# Altium schematic sheet FPGA_Banks.SchDoc
size A3; SheetNumber: 1; SheetTotal: 5
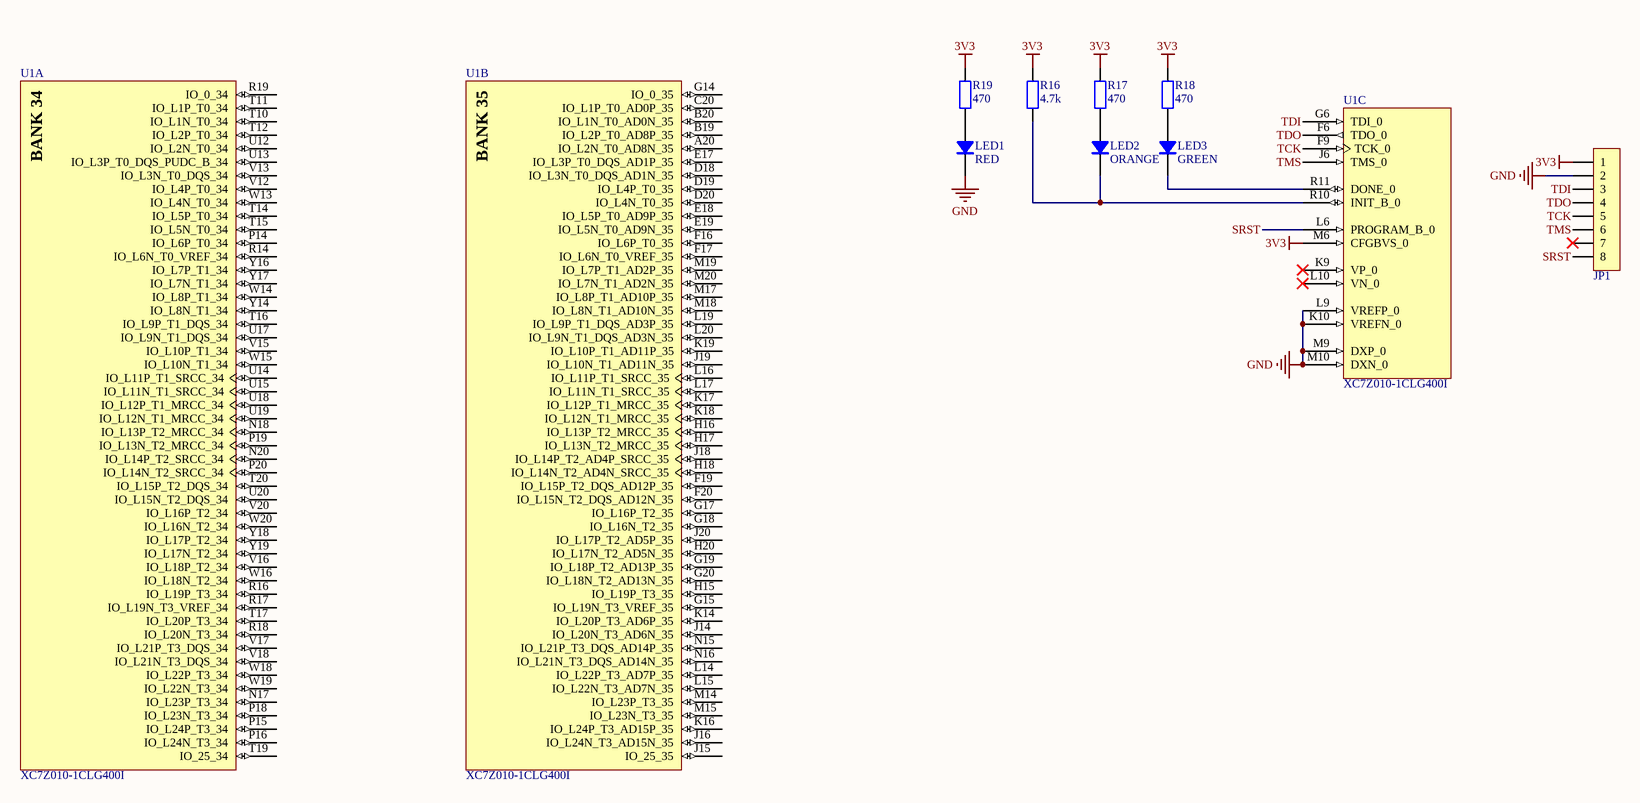
[diagram p0: FPGA_Banks.SchDoc]

## Parts
JP1  HDR-1X8  [HDR2.54-LI-8P]  (value not drawn)
LED1  RED  [LED 0603R]
LED2  ORANGE  [LED 0603Y]
LED3  GREEN  [LED 0603G]
R16  4.7k  [R0402]
R17  470  [R0402]
R18  470  [R0402]
R19  470  [R0402]
U1  XC7Z010-1CLG400I  [CLG400]  (parts A,B,C of 9)

## Nets
3V3: JP1.1 R16.1 R17.1 R18.1 R19.1 U1.M6(CFGBVS_0)
GND: JP1.2 LED1.2(K) U1.K10(VREFN_0) U1.L9(VREFP_0) U1.M9(DXP_0) U1.M10(DXN_0)
SRST: JP1.8 U1.L6(PROGRAM_B_0)
TCK: JP1.5 U1.F9(TCK_0)
TDI: JP1.3 U1.G6(TDI_0)
TDO: JP1.4 U1.F6(TDO_0)
TMS: JP1.6 U1.J6(TMS_0)
NetLED1_1: LED1.1(A) R19.2
NetLED2_1: LED2.1(A) R17.2
NetLED2_2: LED2.2(K) R16.2 U1.R10(INIT_B_0)
NetLED3_1: LED3.1(A) R18.2
NetLED3_2: LED3.2(K) U1.R11(DONE_0)

Not connected (* = marked no-connect by the designer): JP1 7*; U1 A20(IO_L2N_T0_AD8N_35) B19(IO_L2P_T0_AD8P_35) B20(IO_L1N_T0_AD0N_35) C20(IO_L1P_T0_AD0P_35) D18(IO_L3N_T0_DQS_AD1N_35) D19(IO_L4P_T0_35) D20(IO_L4N_T0_35) E17(IO_L3P_T0_DQS_AD1P_35) E18(IO_L5P_T0_AD9P_35) E19(IO_L5N_T0_AD9N_35) F16(IO_L6P_T0_35) F17(IO_L6N_T0_VREF_35) F19(IO_L15P_T2_DQS_AD12P_35) F20(IO_L15N_T2_DQS_AD12N_35) G14(IO_0_35) G15(IO_L19N_T3_VREF_35) G17(IO_L16P_T2_35) G18(IO_L16N_T2_35) G19(IO_L18P_T2_AD13P_35) G20(IO_L18N_T2_AD13N_35) H15(IO_L19P_T3_35) H16(IO_L13P_T2_MRCC_35) H17(IO_L13N_T2_MRCC_35) H18(IO_L14N_T2_AD4N_SRCC_35) H20(IO_L17N_T2_AD5N_35) J14(IO_L20N_T3_AD6N_35) J15(IO_25_35) J16(IO_L24N_T3_AD15N_35) J18(IO_L14P_T2_AD4P_SRCC_35) J19(IO_L10N_T1_AD11N_35) J20(IO_L17P_T2_AD5P_35) K9(VP_0)* K14(IO_L20P_T3_AD6P_35) K16(IO_L24P_T3_AD15P_35) K17(IO_L12P_T1_MRCC_35) K18(IO_L12N_T1_MRCC_35) K19(IO_L10P_T1_AD11P_35) L10(VN_0)* L14(IO_L22P_T3_AD7P_35) L15(IO_L22N_T3_AD7N_35) L16(IO_L11P_T1_SRCC_35) L17(IO_L11N_T1_SRCC_35) L19(IO_L9P_T1_DQS_AD3P_35) L20(IO_L9N_T1_DQS_AD3N_35) M14(IO_L23P_T3_35) M15(IO_L23N_T3_35) M17(IO_L8P_T1_AD10P_35) M18(IO_L8N_T1_AD10N_35) M19(IO_L7P_T1_AD2P_35) M20(IO_L7N_T1_AD2N_35) N15(IO_L21P_T3_DQS_AD14P_35) N16(IO_L21N_T3_DQS_AD14N_35) N17(IO_L23P_T3_34) N18(IO_L13P_T2_MRCC_34) N20(IO_L14P_T2_SRCC_34) P14(IO_L6P_T0_34) P15(IO_L24P_T3_34) P16(IO_L24N_T3_34) P18(IO_L23N_T3_34) P19(IO_L13N_T2_MRCC_34) P20(IO_L14N_T2_SRCC_34) R14(IO_L6N_T0_VREF_34) R16(IO_L19P_T3_34) R17(IO_L19N_T3_VREF_34) R18(IO_L20N_T3_34) R19(IO_0_34) T10(IO_L1N_T0_34) T11(IO_L1P_T0_34) T12(IO_L2P_T0_34) T14(IO_L5P_T0_34) T15(IO_L5N_T0_34) T16(IO_L9P_T1_DQS_34) T17(IO_L20P_T3_34) T19(IO_25_34) T20(IO_L15P_T2_DQS_34) U12(IO_L2N_T0_34) U13(IO_L3P_T0_DQS_PUDC_B_34) U14(IO_L11P_T1_SRCC_34) U15(IO_L11N_T1_SRCC_34) U17(IO_L9N_T1_DQS_34) U18(IO_L12P_T1_MRCC_34) U19(IO_L12N_T1_MRCC_34) U20(IO_L15N_T2_DQS_34) V12(IO_L4P_T0_34) V13(IO_L3N_T0_DQS_34) V15(IO_L10P_T1_34) V16(IO_L18P_T2_34) V17(IO_L21P_T3_DQS_34) V18(IO_L21N_T3_DQS_34) V20(IO_L16P_T2_34) W13(IO_L4N_T0_34) W14(IO_L8P_T1_34) W15(IO_L10N_T1_34) W16(IO_L18N_T2_34) W18(IO_L22P_T3_34) W19(IO_L22N_T3_34) W20(IO_L16N_T2_34) Y14(IO_L8N_T1_34) Y16(IO_L7P_T1_34) Y17(IO_L7N_T1_34) Y18(IO_L17P_T2_34) Y19(IO_L17N_T2_34)

## Notes on the sheet
- (in symbol CMP-0363-00008-3, part A) BANK 34
- (in symbol CMP-0363-00008-3, part B) BANK 35

## Library data of the parts
JP1 = Header 8: 8P接插件; 版权归属: 源创客; BOM名称: 8P接插件; 学习资源: www.ooocke.com
LED1-LED3 = D
R16-R19 = R
U1 = CMP-0363-00008-3: 667 MHz Zynq™-7000 AP SoC, 130 PS I/O, 100 FPGA I/O, 400-Ball BGA, Speed Grade 1, Industrial Grade, Pb-Free; Speed Grade: -1; LUTs: 17600; Extensible Block RAM (# 36Kb Blocks): 240 KB (60); Flip Flops: 35200; PartNumber: XC7Z010-1CLG400I; Mounting Technology: Surface Mount; ComponentLink5URL: http://www.xilinx.com/support/documentation/user_guides/ug865-Zynq-7000-Pkg-Pinout.pdf; ComponentLink3URL: http://www.xilinx.com/support/documentation/data_sheets/ds187-XC7Z010-XC7Z020-Data-Sheet.pdf; PackageVersion: Rev 1.1, 09/2012; ComponentLink2Description: Package Specification; ComponentLink4Description: Package File; ComponentLink2URL: http://www.xilinx.com/support/documentation/user_guides/ug865-Zynq-7000-Pkg-Pinout.pdf; ComponentLink3Description: DC and AC Switching Characteristics; ComponentLink6Description: PCB and Layout Guide; ComponentLink4URL: http://www.xilinx.com/support/packagefiles/z7packages/xc7z010clg400pkg.txt; ComponentLink1URL: http://www.xilinx.com/support/documentation/data_sheets/ds190-Zynq-7000-Overview.pdf; Generic Part Number: XC7Z010; PackageReference: CLG400; ComponentLink1Description: Datasheet; RoHS: Pb-Free; ComponentLink6URL: http://www.xilinx.com/support/documentation/user_guides/ug483_7Series_PCB.pdf; DatasheetVersion: v1.2; PackageDescription: Wire-Bond Chip-Scale BGA, Body 17 x 17 mm, 0.8 mm Pitch; ComponentLink5Description: Packaging and Pinout; Code_JEDEC: MO-275-MMAA-1